# EAGLE design hifiberry_breakout (EAGLE 7.5.0)
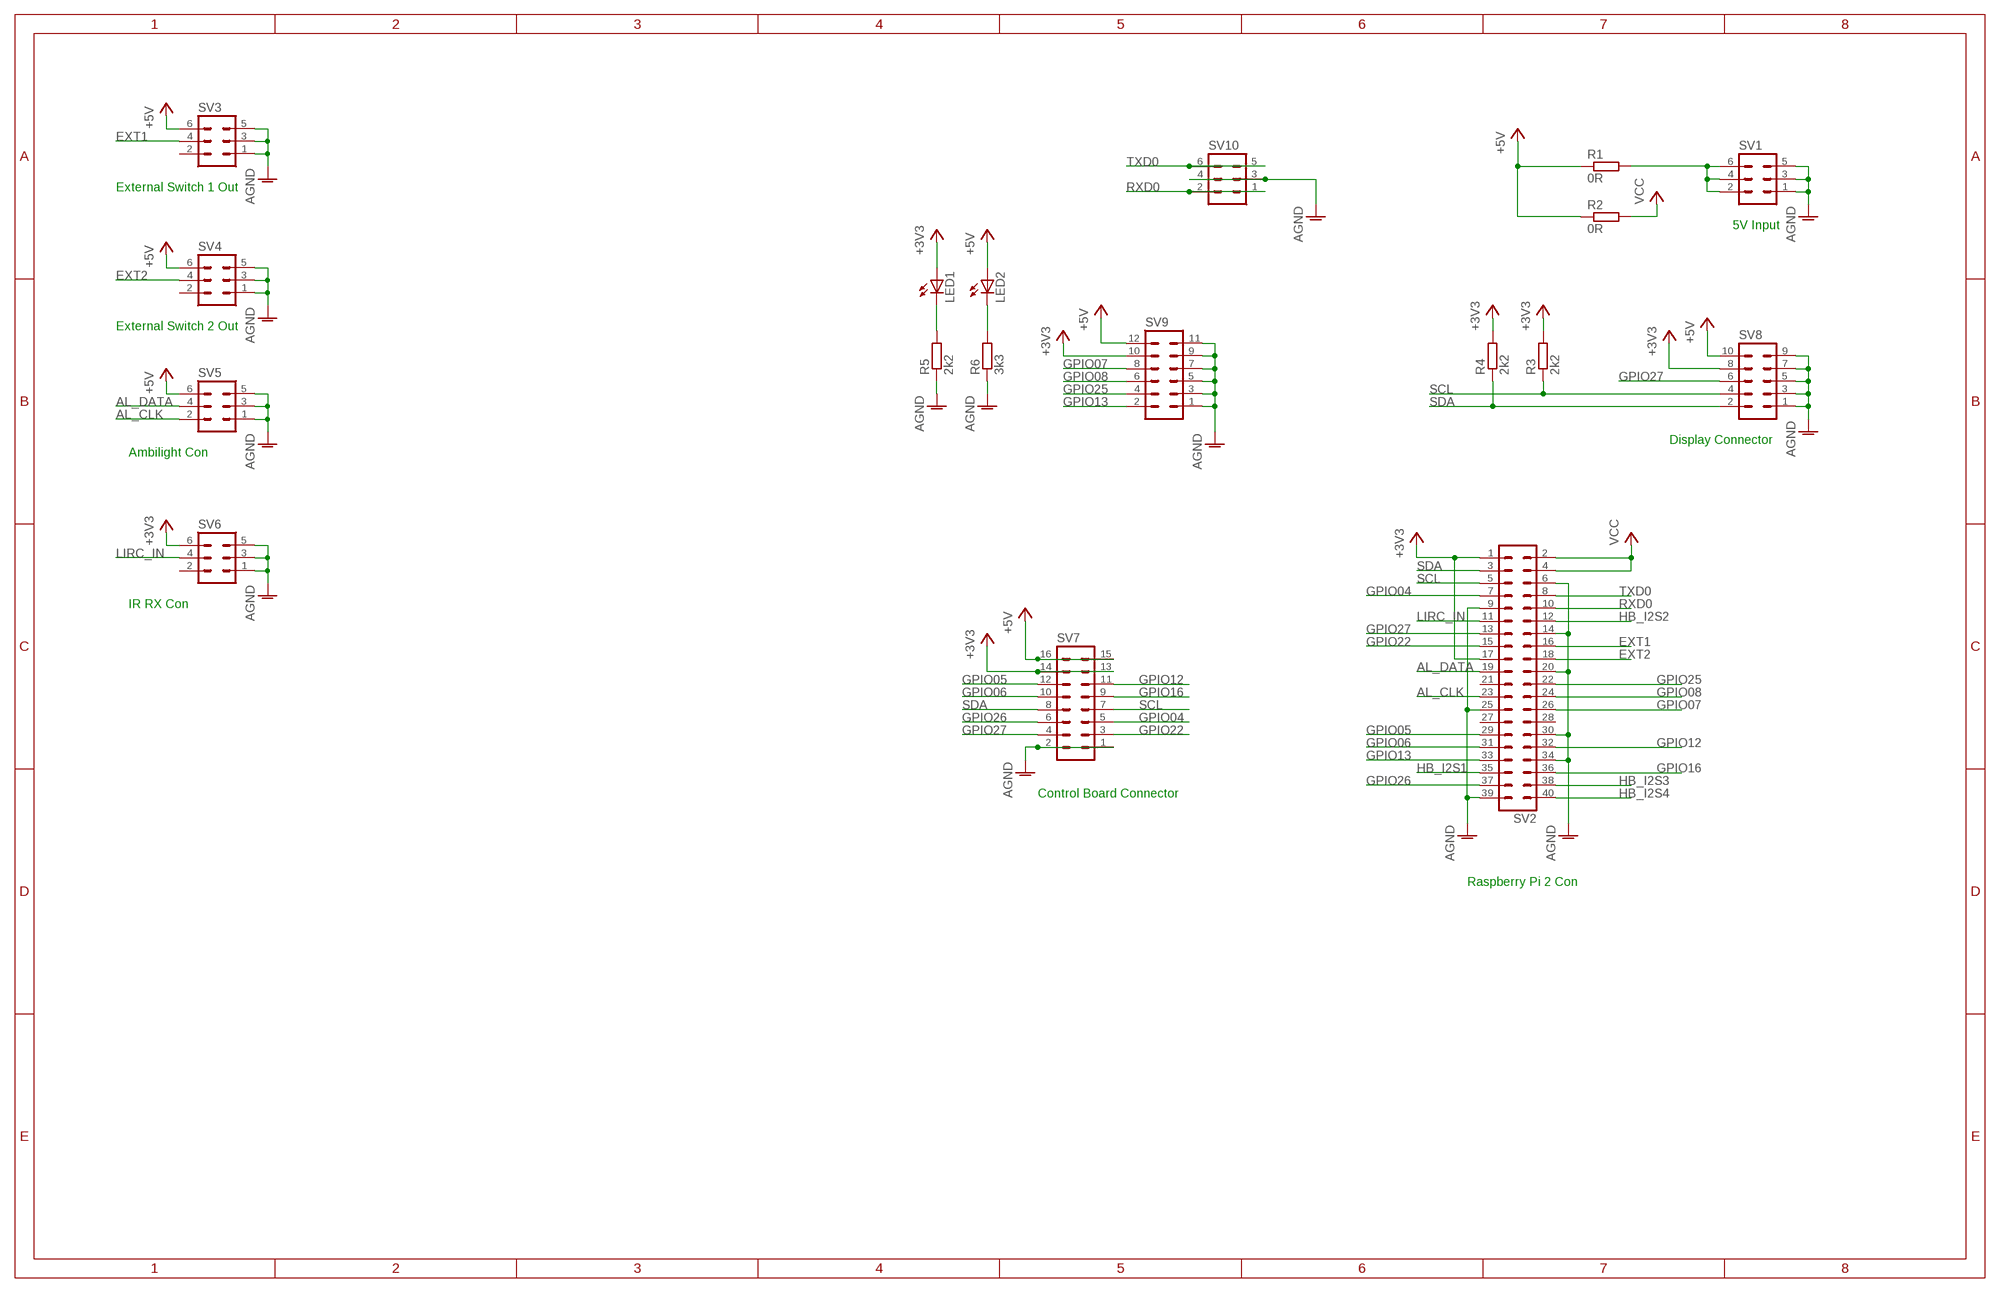
[diagram p0: schematic, sheet 1]

## Parts
LED1  LEDCHIPLED_0603  [CHIPLED_0603]
LED2  LEDCHIPLED_0603  [CHIPLED_0603]
R1  0R  R-EU_R1206  [R1206]
R2  0R  R-EU_R1206  [R1206]
R3  2k2  R-EU_R0603  [R0603]
R4  2k2  R-EU_R0603  [R0603]
R5  2k2  R-EU_R0603  [R0603]
R6  3k3  R-EU_R0603  [R0603]
SV1  MA03-2  [MA03-2]
SV2  MA20-2  [MA20-2]
SV3  MA03-2  [MA03-2]
SV4  MA03-2  [MA03-2]
SV5  MA03-2  [MA03-2]
SV6  MA03-2  [MA03-2]
SV7  MA08-2  [MA08-2]
SV8  MA05-2  [MA05-2]
SV9  MA06-2  [MA06-2]
SV10  MA03-2  [MA03-2]

## Nets
+3V3: LED1.A R3.2 R4.2 SV2.1 SV2.17 SV6.6 SV7.13 SV7.14 SV8.8 SV9.10
+5V: LED2.A R1.1 R2.1 SV3.6 SV4.6 SV5.6 SV7.15 SV7.16 SV8.10 SV9.12
AGND: R5.1 R6.1 SV1.1 SV1.3 SV1.5 SV2.6 SV2.9 SV2.14 SV2.20 SV2.25 SV2.30 SV2.34 SV2.39 SV3.1 SV3.3 SV3.5 SV4.1 SV4.3 SV4.5 SV5.1 SV5.3 SV5.5 SV6.1 SV6.3 SV6.5 SV7.1 SV7.2 SV8.1 SV8.3 SV8.5 SV8.7 SV8.9 SV9.1 SV9.3 SV9.5 SV9.7 SV9.9 SV9.11 SV10.3 SV10.4
AL_CLK: SV2.23 SV5.2
AL_DATA: SV2.19 SV5.4
EXT1: SV2.16 SV3.4
EXT2: SV2.18 SV4.4
GPIO04: SV2.7 SV7.5
GPIO05: SV2.29 SV7.12
GPIO06: SV2.31 SV7.10
GPIO07: SV2.26 SV9.8
GPIO08: SV2.24 SV9.6
GPIO12: SV2.32 SV7.11
GPIO13: SV2.33 SV9.2
GPIO16: SV2.36 SV7.9
GPIO22: SV2.15 SV7.3
GPIO25: SV2.22 SV9.4
GPIO26: SV2.37 SV7.6
GPIO27: SV2.13 SV7.4 SV8.6
HB_I2S1: SV2.35
HB_I2S2: SV2.12
HB_I2S3: SV2.38
HB_I2S4: SV2.40
LIRC_IN: SV2.11 SV6.4
N$2: LED2.C R6.2
N$3: R1.2 SV1.2 SV1.4 SV1.6
N$4: LED1.C R5.2
RXD0: SV2.10 SV10.1 SV10.2
SCL: R3.1 SV2.5 SV7.7 SV8.4
SDA: R4.1 SV2.3 SV7.8 SV8.2
TXD0: SV2.8 SV10.5 SV10.6
VCC: R2.2 SV2.2 SV2.4
Unconnected: SV2.21 SV2.27 SV2.28 SV3.2 SV4.2 SV6.2

## Notes on the sheet
- External Switch 1 Out
- 5V Input
- External Switch 2 Out
- Display Connector
- Ambilight Con
- IR RX Con
- Control Board Connector
- Raspberry Pi 2 Con

## Library data of the parts
LED1 LED2 = led:LED: LED OSRAM: - CHIPLED LG R971, LG N971, LY N971, LG Q971, LY Q971, LO R971, LY R971 LH N974, LH R974 LS Q976, LO Q976, LY Q976 LO Q996 - Hyper CHIPLED LW Q18S LB Q993, LB Q99A, LB R99A - SideLED LS A670, LO A670, LY A670, LG A670, LP A670 LB A673, LV A673, LT A673, LW A673 LH A674 LY A675 LS A676, LA A676, LO A676, LY A676, LW A676 LS A679, LY A679, LG A679 - Hyper Micro SIDELED® LS Y876, LA Y876, LO Y876, LY Y876 LT Y87S - SmartLED LW L88C, LW L88S LB L89C, LB L89S, LG L890 LS L89K, LO L89K, LY L89K LS L896, LA L896, LO L896, LY L896 - TOPLED LS T670, LO T670, LY T670, LG T670, LP T670 LSG T670, LSP T670, LSY T670, LOP T670, LYG T670 LG T671, LOG T671, LSG T671 LB T673, LV T673, LT T673, LW T673 LH T674 LS T676, LA T676, LO T676, LY T676, LB T676, LH T676, LSB T676, LW T676 LB T67C, LV T67C, LT T67C, LS T67K, LO T67K, LY T67K, LW E67C LS E67B, LA E67B, LO E67B, LY E67B, LB E67C, LV E67C, LT E67C LW T67C LS T679, LY T679, LG T679 LS T770, LO T770, LY T770, LG T770, LP T770 LB T773, LV T773, LT T773, LW T773 LH T774 LS E675, LA E675, LY E675, LS T675 LS T776, LA T776, LO T776, LY T776, LB T776 LHGB T686 LT T68C, LB T68C - Hyper Mini TOPLED® LB M676 - Mini TOPLED Santana® LG M470 LS M47K, LO M47K, LY M47K Source: http://www.osram.convergy.de LUXEON: - LUMILED® LXK2-PW12-R00, LXK2-PW12-S00, LXK2-PW14-U00, LXK2-PW14-V00 LXK2-PM12-R00, LXK2-PM12-S00, LXK2-PM14-U00 LXK2-PE12-Q00, LXK2-PE12-R00, LXK2-PE12-S00, LXK2-PE14-T00, LXK2-PE14-U00 LXK2-PB12-K00, LXK2-PB12-L00, LXK2-PB12-M00, LXK2-PB14-N00, LXK2-PB14-P00, LXK2-PB14-Q00 LXK2-PR12-L00, LXK2-PR12-M00, LXK2-PR14-Q00, LXK2-PR14-R00 LXK2-PD12-Q00, LXK2-PD12-R00, LXK2-PD12-S00 LXK2-PH12-R00, LXK2-PH12-S00 LXK2-PL12-P00, LXK2-PL12-Q00, LXK2-PL12-R00 Source: www.luxeon.com KINGBRIGHT: KA-3528ASYC Source: www.kingbright.com
R1-R6 = rcl:R-EU_: RESISTOR, European symbol
SV1 SV3-SV6 SV10 = con-lstb:MA03-2: PIN HEADER; OC_FARNELL: unknown; OC_NEWARK: unknown
SV2 = con-lstb:MA20-2: PIN HEADER; OC_FARNELL: unknown; OC_NEWARK: unknown
SV7 = con-lstb:MA08-2: PIN HEADER; OC_FARNELL: unknown; OC_NEWARK: unknown
SV8 = con-lstb:MA05-2: PIN HEADER; OC_FARNELL: unknown; OC_NEWARK: unknown
SV9 = con-lstb:MA06-2: PIN HEADER; OC_FARNELL: unknown; OC_NEWARK: unknown

## Board
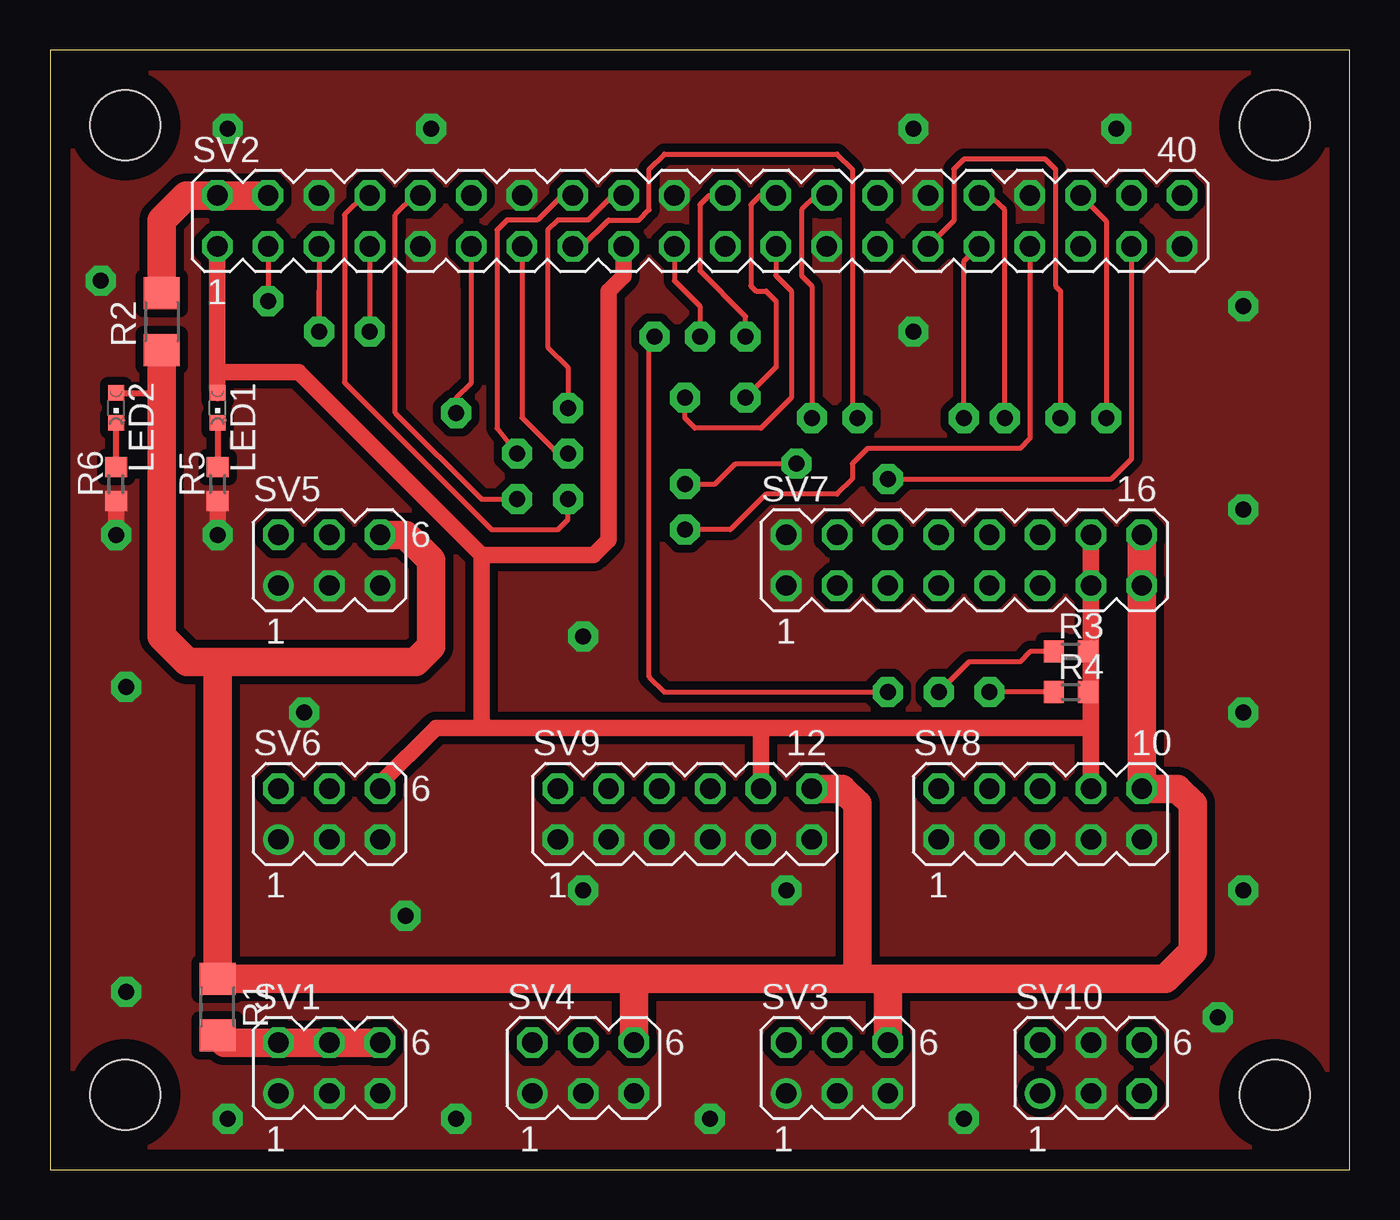
[diagram p1: board, top side]
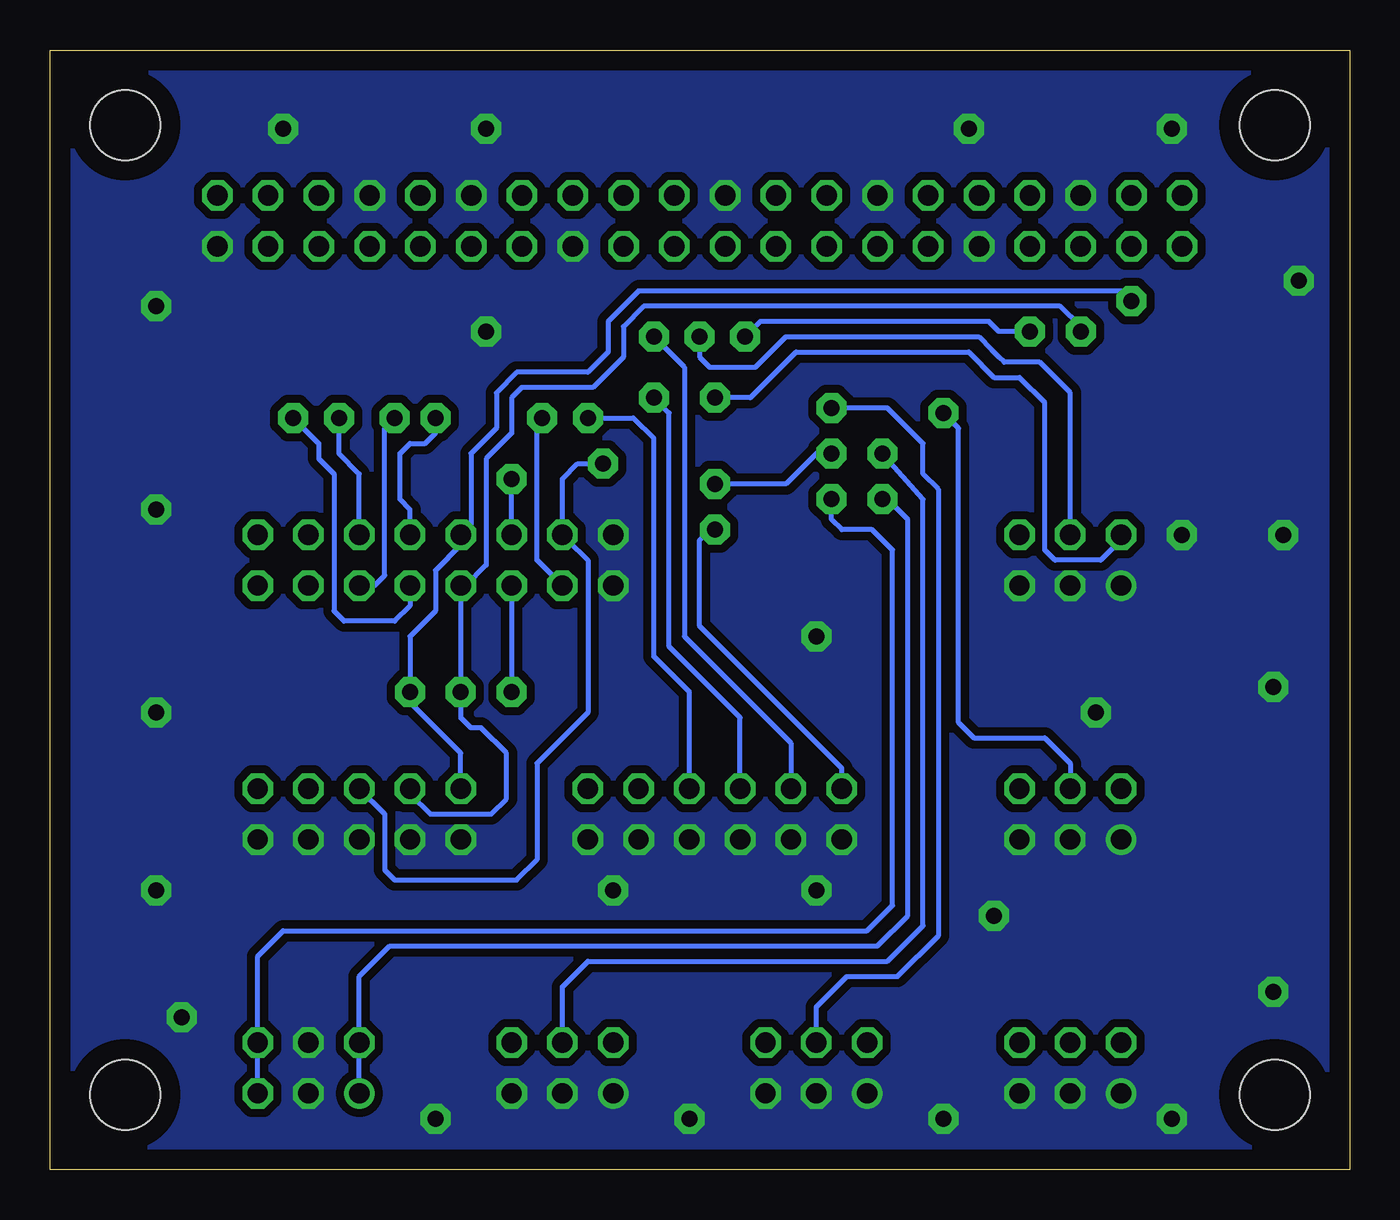
[diagram p2: board, bottom side, seen from below]

Size 65 x 56 mm. Coordinates in mm from the lower left corner, seen from the top.
Outline: 0,0 65,0 65,56 0,56 0,0
Copper layers (1*16): Top 0.035mm / dielectric 1.5mm / Bottom 0.035mm
Design rules "default": minimum track width 10mil, minimum drill 24mil, track to track 8mil, track to pad 8mil, pad to pad 8mil, via to via 8mil, smd to smd 8mil, copper to edge 40mil, drill to drill 8mil, minimum pad ring 10mil, minimum via ring 8mil, stop-mask expansion 4mil, vias tented up to drill 0mil, thermal gap 10mil
Holes 3.5 mm at 3.75,52.25 61.25,52.25 61.25,3.75 3.75,3.75

### Footprints (pad centres in the part's own frame; a part is rotated, then mirrored left to right if it is on the bottom)
CHIPLED_0603 = smd 0.8 x 0.8: A 0,-0.75; C 0,0.75
R1206 = smd 1.6 x 1.803: 1 -1.422,0; 2 1.422,0
R0603 = smd 1 x 1.1: 1 -0.85,0; 2 0.85,0
MA03-2 = drill 1.016: 1 -2.54,-1.27 | drill 1.016 octagon: 2 -2.54,1.27; 3 0,-1.27; 4 0,1.27; 5 2.54,-1.27; 6 2.54,1.27
MA20-2 = drill 1.016 octagon: 1 -24.13,-1.27; 2 -24.13,1.27; 3 -21.59,-1.27; 4 -21.59,1.27; 5 -19.05,-1.27; 6 -19.05,1.27; 7 -16.51,-1.27; 8 -16.51,1.27; 9 -13.97,-1.27; 10 -13.97,1.27; 11 -11.43,-1.27; 12 -11.43,1.27; 13 -8.89,-1.27; 14 -8.89,1.27; 15 -6.35,-1.27; 16 -6.35,1.27; 17 -3.81,-1.27; 18 -3.81,1.27; 19 -1.27,-1.27; 20 -1.27,1.27; 21 1.27,-1.27; 22 1.27,1.27; 23 3.81,-1.27; 24 3.81,1.27; 25 6.35,-1.27; 26 6.35,1.27; 27 8.89,-1.27; 28 8.89,1.27; 29 11.43,-1.27; 30 11.43,1.27; 31 13.97,-1.27; 32 13.97,1.27; 33 16.51,-1.27; 34 16.51,1.27; 35 19.05,-1.27; 36 19.05,1.27; 37 21.59,-1.27; 38 21.59,1.27; 39 24.13,-1.27; 40 24.13,1.27
MA08-2 = drill 1.016 octagon: 1 -8.89,-1.27; 2 -8.89,1.27; 3 -6.35,-1.27; 4 -6.35,1.27; 5 -3.81,-1.27; 6 -3.81,1.27; 7 -1.27,-1.27; 8 -1.27,1.27; 9 1.27,-1.27; 10 1.27,1.27; 11 3.81,-1.27; 12 3.81,1.27; 13 6.35,-1.27; 14 6.35,1.27; 15 8.89,-1.27; 16 8.89,1.27
MA05-2 = drill 1.016 octagon: 1 -5.08,-1.27; 2 -5.08,1.27; 3 -2.54,-1.27; 4 -2.54,1.27; 5 0,-1.27; 6 0,1.27; 7 2.54,-1.27; 8 2.54,1.27; 9 5.08,-1.27; 10 5.08,1.27
MA06-2 = drill 1.016 octagon: 1 -6.35,-1.27; 2 -6.35,1.27; 3 -3.81,-1.27; 4 -3.81,1.27; 5 -1.27,-1.27; 6 -1.27,1.27; 7 1.27,-1.27; 8 1.27,1.27; 9 3.81,-1.27; 10 3.81,1.27; 11 6.35,-1.27; 12 6.35,1.27

### Placement (x,y rotation side)
LED1  8.38,38.1 180 top
LED2  3.3,38.1 180 top
R1  8.38,8.13 270 top
R2  5.59,42.42 90 top
R3  51.05,25.91 0 top
R4  51.05,23.88 0 top
R5  8.38,34.29 90 top
R6  3.3,34.29 90 top
SV1  13.97,5.08 0 top
SV2  32.5,47.45 0 top
SV3  39.37,5.08 0 top
SV4  26.67,5.08 0 top
SV5  13.97,30.48 0 top
SV6  13.97,17.78 0 top
SV7  45.72,30.48 0 top
SV8  49.53,17.78 0 top
SV9  31.75,17.78 0 top
SV10  52.07,5.08 0 top

### Tracks (layer width: path | path; a pad name or v marks a point on that pad's centre or on a via)
+3V3
  Top 0.254: R3.2 52.07,25.91 | R4.2 51.9,23.79 52.07,23.62
  Top 0.813: LED1.A 8.37,39.09 SV2.1 8.37,39.89 8.38,39.88 12.45,39.88 21.59,30.73 | SV7.14 SV7.13 52.07,25.91 52.07,23.62 52.07,22.1 | 52.07,22.1 SV8.8 | SV9.10 35.56,22.1 | 35.56,22.1 52.07,22.1 | SV6.6 16.51,19.3 19.3,22.1 21.84,22.1 | 21.59,30.73 21.59,22.35 21.84,22.1 | 35.56,22.1 21.84,22.1 | SV2.17 28.69,44.69 27.94,43.94 27.94,31.5 27.18,30.73 21.59,30.73
+5V
  Top 0.254: 5.6,38.85 5.6,39.1 5.59,39.12
  Top 0.305: LED2.A 5.6,38.85 5.84,38.61
  Top 1.422: SV7.16 SV7.15 SV8.10 56.39,19.05 57.15,18.29 57.15,10.92 55.78,9.55 41.91,9.55 | R1.1 29.21,9.55 | 8.33,9.5 R1.1 | SV3.6 41.91,9.55 | 41.91,9.55 40.64,9.55 | 40.64,9.55 29.21,9.55 | SV4.6 29.21,9.55 | SV5.6 17.78,31.75 19.05,30.48 19.05,26.16 18.29,25.4 8.38,25.4 | SV9.12 39.62,19.05 40.39,18.29 40.39,9.8 40.64,9.55 | 8.38,25.4 R1.1 | R2.1 5.59,39.12 5.59,26.67 6.86,25.4 8.38,25.4
AGND  (via drill 0.8 pad 1.5)
  Top 0.813: R6.1 v3.3,31.75 | R5.1 v8.38,31.75
  other vias: 8.89,52.07 19.05,52.07 43.18,52.07 53.34,52.07 43.18,41.91 59.69,43.18 59.69,33.02 59.69,22.86 59.69,13.97 58.42,7.62 45.72,2.54 33.02,2.54 20.32,2.54 8.89,2.54 3.81,8.89 36.83,13.97 26.67,26.67 17.78,12.7 26.67,13.97 12.7,22.86 3.81,24.13 2.54,44.45
  pour Bottom (isolate 0.406, no thermals): 0,55.88 64.77,55.88 64.77,0 0,0
  pour Top (isolate 0.406, no thermals): 0,55.88 64.77,55.88 64.77,0 0,0
AL_CLK  (via drill 0.8 pad 1.5)
  Top 0.254: SV2.23 36.31,44.72 37.08,43.94 37.08,38.61 35.56,37.08 32.26,37.08 31.75,37.59 v31.75,38.61
  Bottom 0.254: SV5.2 11.43,31.5 12.45,30.48 14.73,30.48 15.24,30.99 15.24,38.35 16.51,39.62 17.78,39.62 19.05,40.89 27.69,40.89 29.97,38.61 v31.75,38.61
AL_DATA  (via drill 0.8 pad 1.5)
  Top 0.254: v32.51,41.66 32.51,43.18 31.23,44.46 SV2.19
  Bottom 0.254: SV5.4 13.97,38.86 15.49,40.39 17.27,40.39 17.53,40.64 17.91,41.02 18.54,41.66 28.19,41.66 29.72,40.13 32,40.13 32.51,40.64 v32.51,41.66
EXT1  (via drill 0.8 pad 1.5)
  Top 0.254: SV2.16 25.61,48.72 24.38,47.5 22.86,47.5 22.35,46.99 22.35,37.08 v23.37,35.81
  Bottom 0.254: SV3.4 39.37,9.14 38.1,10.41 23.11,10.41 21.34,12.19 21.34,33.53 v23.37,35.81
EXT2  (via drill 0.8 pad 1.5)
  Top 0.254: SV2.18 28.15,48.72 26.92,47.5 25.4,47.5 24.89,46.99 24.89,41.15 25.91,40.13 v25.91,38.1
  Bottom 0.254: SV4.4 26.67,8.13 25.15,9.65 22.61,9.65 20.57,11.68 20.57,34.04 21.34,34.8 21.34,36.32 23.11,38.1 v25.91,38.1
GPIO04  (via drill 0.8 pad 1.5)
  Top 0.254: SV2.7 v15.99,41.92 | v41.91,23.88 30.73,23.88 29.97,24.64 29.97,41.4 v30.23,41.66
  Bottom 0.254: SV7.5 v41.91,23.88 | v15.99,41.92 17.54,41.92 18.03,42.42 29.46,42.42 v30.23,41.66
GPIO05  (via drill 0.8 pad 1.5)
  Top 0.254: SV2.29 45.21,47.46 45.21,50.04 45.72,50.55 49.78,50.55 50.29,50.04 50.29,44.2 50.55,43.94 v50.55,37.59
  Bottom 0.254: SV7.12 49.53,34.8 50.55,35.81 v50.55,37.59
GPIO06  (via drill 0.8 pad 1.5)
  Top 0.254: v45.72,37.59 45.72,45.43 SV2.31
  Bottom 0.254: SV7.10 46.99,33.02 47.5,33.53 47.5,35.81 46.99,36.32 46.23,36.32 45.72,36.83 v45.72,37.59
GPIO07  (via drill 0.8 pad 1.5)
  Top 0.254: SV2.26 38.31,48.72 37.59,48.01 37.59,44.7 38.1,44.2 v38.1,37.59
  Bottom 0.254: SV9.8 33.02,23.88 34.8,25.65 34.8,36.58 35.81,37.59 v38.1,37.59
GPIO08  (via drill 0.8 pad 1.5)
  Top 0.254: SV2.24 35.51,48.72 35.05,48.26 35.05,44.2 35.31,43.94 35.81,43.94 36.32,43.43 36.32,40.13 v34.8,38.61
  Bottom 0.254: SV9.6 30.48,22.61 34.04,26.16 34.04,37.85 v34.8,38.61
GPIO12  (via drill 0.8 pad 1.5)
  Top 0.254: SV2.32 47.04,48.72 47.62,48.13 47.75,48.01 v47.75,37.59
  Bottom 0.254: SV7.11 48.77,29.21 48.26,29.72 48.26,37.08 v47.75,37.59
GPIO13  (via drill 0.8 pad 1.5)
  Top 0.254: SV2.33 49.02,46.17 49.02,36.58 48.51,36.07 40.89,36.07 40.13,35.31 40.13,34.54 39.37,33.78 35.81,33.78 34.04,32 v31.75,32
  Bottom 0.254: SV9.2 25.4,20.07 32.51,27.18 32.51,31.5 32,32 v31.75,32
GPIO16  (via drill 0.8 pad 1.5)
  Top 0.254: SV2.36 52.83,47.44 v52.83,37.59
  Bottom 0.254: SV7.9 46.99,28.19 47.75,27.43 50.29,27.43 50.8,27.94 50.8,34.8 51.56,35.56 51.56,36.32 v52.83,37.59
GPIO22  (via drill 0.8 pad 1.5)
  Top 0.254: SV2.15 26.62,46.18 27.94,47.5 29.46,47.5 29.97,48.01 29.97,50.04 30.73,50.8 39.37,50.8 40.13,50.04 40.13,37.85 v40.39,37.59
  Bottom 0.254: SV7.3 40.64,30.48 40.64,37.34 v40.39,37.59
GPIO25  (via drill 0.8 pad 1.5)
  Top 0.254: SV2.22 32.97,48.72 32.51,48.26 32.51,44.96 34.8,42.67 v34.8,41.66
  Bottom 0.254: SV9.4 27.94,21.34 33.27,26.67 33.27,40.13 v34.8,41.66
GPIO26  (via drill 0.8 pad 1.5)
  Top 0.254: v41.91,34.54 53.09,34.54 54.1,35.56 54.1,46.17 SV2.37
  Bottom 0.254: SV7.6 v41.91,34.54
GPIO27  (via drill 0.8 pad 1.5)
  Top 0.254: SV2.13 23.61,37.6 25.4,35.81 v25.91,35.81 | v31.75,34.29 33.27,34.29 34.29,35.31 v37.34,35.31
  Bottom 0.254: SV8.6 48.26,17.78 48.26,14.99 47.75,14.48 41.66,14.48 40.64,15.49 40.64,20.32 38.1,22.86 38.1,30.48 39.12,31.5 39.37,31.5 SV7.4 39.37,34.54 38.61,35.31 v37.34,35.31 | v25.91,35.81 26.67,35.81 28.19,34.29 v31.75,34.29
LIRC_IN  (via drill 0.8 pad 1.5)
  Top 0.254: SV2.11 21.07,44.18 21.08,44.17 21.08,39.37 20.32,38.61 v20.32,37.85
  Bottom 0.254: SV6.4 13.97,20.32 15.24,21.59 18.8,21.59 19.56,22.35 19.56,37.08 v20.32,37.85
N$2
  Top 0.305: R6.2 LED2.C
N$3
  Top 1.422: SV1.6 SV1.4 SV1.2 8.74,6.35 R1.2
N$4
  Top 0.305: LED1.C R5.2
RXD0  (via drill 0.8 pad 1.5)
  Top 0.254: SV2.10 18.24,48.72 17.27,47.75 17.27,37.85 21.59,33.53 v23.37,33.53
  Bottom 0.254: SV10.1 SV10.2 49.53,9.65 48.01,11.18 23.62,11.18 22.1,12.7 22.1,32.51 23.11,33.53 v23.37,33.53
SCL  (via drill 0.8 pad 1.5)
  Top 0.254: SV2.5 v13.45,41.92 13.46,43.94 | R3.1 49.02,25.91 48.51,25.4 45.97,25.4 v44.45,23.88
  Bottom 0.254: SV8.4 46.99,18.8 45.97,17.78 42.93,17.78 42.16,18.54 42.16,20.83 43.43,22.1 43.94,22.1 44.45,22.61 v44.45,23.88 SV7.7 44.2,29.21 43.18,30.23 43.18,35.56 41.91,36.83 41.91,38.61 41.4,39.12 37.85,39.12 36.32,40.64 36.32,42.16 35.31,43.18 14.48,43.18 13.45,42.15 v13.45,41.92
SDA  (via drill 0.8 pad 1.5)
  Top 0.254: SV2.3 v10.91,43.45 10.92,43.94 | R4.1 v46.99,23.88
  Bottom 0.254: SV8.2 44.45,20.83 46.99,23.37 v46.99,23.88 46.99,26.67 45.72,27.94 45.72,29.97 44.45,31.24 SV7.8 43.94,32.26 43.94,35.81 42.67,37.08 42.67,38.86 41.66,39.88 38.1,39.88 37.08,40.89 37.08,42.42 35.55,43.95 11.42,43.95 v10.91,43.45
TXD0  (via drill 0.8 pad 1.5)
  Top 0.254: SV2.8 15.7,48.72 14.73,47.75 14.73,39.37 22.1,32 25.4,32 25.91,32.51 v25.91,33.53
  Bottom 0.254: SV10.5 SV10.6 54.61,10.67 53.34,11.94 24.13,11.94 22.86,13.21 22.86,30.99 23.88,32 25.4,32 25.91,32.51 v25.91,33.53
VCC
  Top 1.422: SV2.4 SV2.2 6.81,48.72 5.59,47.5 R2.2